# Altium schematic sheet LEDS! Schematic.SchDoc: * Practice schematic
size A4; Author: * Yina Jiang; DrawnBy: * Yina Jiang; SheetNumber: 1; SheetTotal: 1
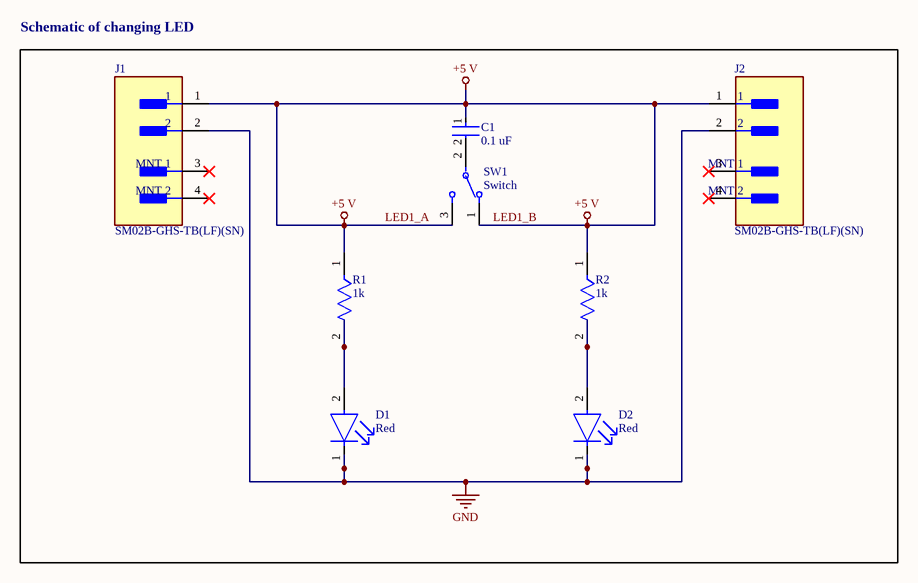
[diagram p0: LEDS! Schematic.SchDoc]

## Parts
C1  0.1 uF  [FP-GRM155-0_05-IPC_C]
D1  Red  [FP-LTST-C230EKT-MFG]
D2  Red  [FP-LTST-C230EKT-MFG]
J1  SM02B-GHS-TB(LF)(SN)  [FP-SM02B-GHS-TB_LF_SN-MFG]
J2  SM02B-GHS-TB(LF)(SN)  [FP-SM02B-GHS-TB_LF_SN-MFG]
R1  1k  [FP-RN73R1J-IPC_A]
R2  1k  [FP-RN73R1J-IPC_A]
SW1  Switch  [FP-7103SYCQE-MFG]

## Blocks framed on the sheet
Schematic of changing LED: C1 D1 D2 J1 J2 R1 R2 SW1

## Nets
GND: D1.1(C) D2.1(C) J1.2 J2.2
LED1_A: C1.1 J1.1 J2.1 R1.1 R2.1 SW1.1 SW1.3  [also labelled +5 V, LED1_B]
NetC1_2: C1.2 SW1.2(COMM)
NetD1_2: D1.2(A) R1.2
NetD2_2: D2.2(A) R2.2

Not connected (* = marked no-connect by the designer): J1 3(MNT_1)* 4(MNT_2)*; J2 3(MNT_1)* 4(MNT_2)*

## Library data of the parts
C1 = CMP-06035-003995-1: Chip Multilayer Ceramic Capacitors for General Purpose, 0402, 0.10uF, X7R, 15%, 10%, 25V; Capacitance: 100nF; Resistor Type: Ceramic; Tolerance: 10%; Case Code (Metric): 1005; Termination: SMD/SMT; Mount: Surface Mount; Voltage Rating: 25V; Voltage Rating (DC): 25V; Case Code (Imperial): 0402; Max Operating Temperature: 125°C; Weight: 0.000212oz; Case/Package: 0402; Length: 0.039inch; Width: 0.5mm; Thickness: 0.022inch; Height: 0.5mm; Packaging: Tape and Reel; Package Quantity: 50000; Min Operating Temperature: -55°C; Dielectric: X7R
D1 D2 = CMP-22017-000030-1: LED RED CLEAR CHIP SMD; Forward Current: 30mA; Test Current: 10mA; Number of Elements: 1; Viewing Angle: 130°; Dominant Wavelength: 621nm; Forward Voltage: 2V; Lens Style: Diffused; Power Rating: 100mW; Reverse Voltage: 5V; Wavelength: 630nm; Luminous Intensity: 6mcd; Lens Color: Colorless; Case/Package: 1206; Case Code (Imperial): 1206; Package Quantity: 1; Lead Free: Lead Free; Case Code (Metric): 3216; Height: 1.1mm; Lens Transparency: Clear; Mount: Surface Mount; Depth: 1.6mm; Number of LEDs: 1; Power Dissipation: 100mW; Max Operating Temperature: 85°C; Width: 1.6mm; Color: Red; Number of Pins: 2; Min Operating Temperature: -55°C; Packaging: Tape and Reel; Radiation Hardening: No; Illumination Color: Red; Length: 3.2mm
J1 J2 = CMP-2000-07076-2: CONN HEADER SMD R/A 2POS 1.25MM; Voltage Rating: 50V; Number of Positions: 2; Pitch: 0.049inch; Current Rating: 1A; Connector Type: Outer Shroud Contact; Number of Rows: 1; Contact Material: Bronze; Termination: Solder; Color: Natural; Package Quantity: 2500; Mount: Surface Mount; Housing Color: Natural; Number of Contacts: 2; Packaging: Tape and Reel; Lead Free: Lead Free; Housing Material: Nylon; Orientation: Right Angle; Contact Type: Male Pin; Contact Plating: Tin; Series: GH; Fastening Type: Latch
R1 R2 = CMP-04015-029754-1: 3kΩ ±1% 0.1W, 1/10W Chip Resistor 0603 (1608 Metric) Moisture Resistant Thin Film
SW1 = CMP-10041-000002-1: SWITCH TOGGLE SPDT 5A 120V; Approvals: UL; Body Material: Stainless Steel; Switch Function: On-Off-On; Number of Poles: 1; Illumination Type: Non-Illuminated; Max Voltage Rating (AC): 250V; Electrical Life: 40000Cycles; Max Voltage Rating (DC): 28V; Number of Positions: 3; Actuator Length: 10.67mm; Actuator Type: Standard Round; Insulation Resistance: 1GR; Actuator Material: Brass; RoHS Compliant: Yes; Orientation: Straight; Packaging: Bulk; Lead Free: Lead Free; Termination: PC Pin; Length: 12.7mm; Housing Material: Stainless Steel; Mount: Panel; REACH SVHC: No SVHC; Throw Configuration: SPDT; Voltage Rating (AC): 120V; Current Rating: 5A; Series: 7000; Radiation Hardening: No; Voltage Rating (DC): 28V; Max Current Rating: 5A; Max Operating Temperature: 85°C; Min Operating Temperature: -30°C; Contact Plating: Silver; Contact Material: Silver; Depth: 6.86mm; Package Quantity: 1